# Altium schematic sheet in_out_ports.SchDoc
size A; SheetNumber: 2; SheetTotal: 4
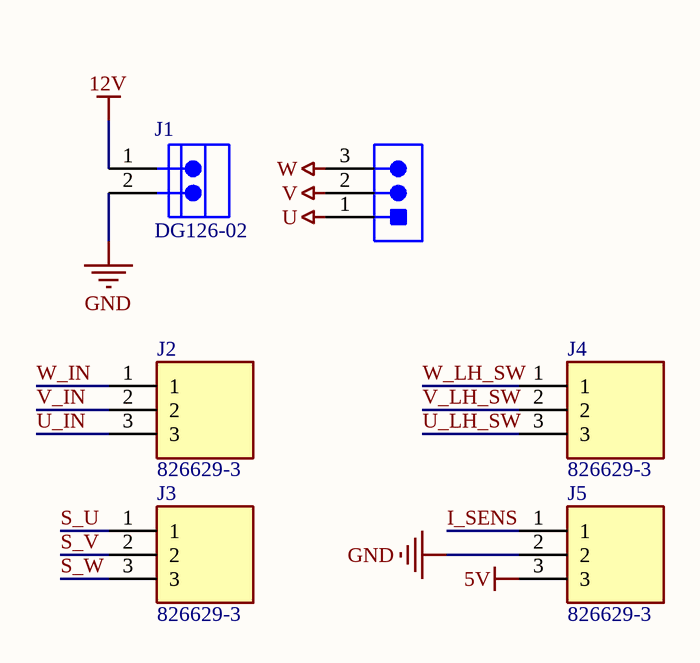
[diagram p0: in_out_ports.SchDoc]

## Parts
J1  DG126-02  [CXKF-KF129C-2_V]
J2  826629-3  [HDRV3W63P0X254_1X3_762X250X950P]
J3  826629-3  [HDRV3W63P0X254_1X3_762X250X950P]
J4  826629-3  [HDRV3W63P0X254_1X3_762X250X950P]
J5  826629-3  [HDRV3W63P0X254_1X3_762X250X950P]
MOTOR  SCREW-5.0/5.08 3WAYS  [SCREW-5.0-3WAYS_V]  (value not drawn)

## Nets
5V: J5.3
12V: J1.1
GND: J1.2 J5.2
U: MOTOR.1
V: MOTOR.2
W: MOTOR.3
I_SENS: J5.1
S_U: J3.1
S_V: J3.2
S_W: J3.3
U_IN: J2.3
U_LH_SW: J4.3
V_IN: J2.2
V_LH_SW: J4.2
W_IN: J2.1
W_LH_SW: J4.1

## Library data of the parts
J1 = CMP-0813-00004-1: Euro Terminal Block, 20 A, 300 V, -40 to 105 degC, Pitch 5 mm, 1 x 2 Position, Height 19.2 mm, Tail Length 3.5 mm; PartNumber: KF129C-02P-14; Manufacturer: Cixi KaiFeng; Insulation Resistance: 5000 MOhm / 1000 V; Pitch: Single Pitch; No. of Pole: 2; Rated Voltage: 300 V; Contact: Brass; Rated Current: 20 A; Contact Resistance: 20 mOhm; Withstanding Voltage: AC 1500 V / 1 Min; ComponentLink2Description: Datasheet; PackageReference: KF129C-2; ComponentLink1URL: http://www.nb-kaifeng.com/; ComponentLink2URL: http://www.nb-kaifeng.com/upload/editor/ext_pdf/201208170644598657.pdf; Color: Green; PackageDescription: Terminal Block, Pitch 5 mm, 1 x 2 Position, Height 19.2 mm, Tail Length 3.5 mm; Temp. Range: -40 to 105 degC; Mounting Technology: Through Hole; ComponentLink1Description: Manufacturer URL
J2-J5 = 826629-3: Connector; Manufacturer_Name: TE Connectivity; Datasheet Link: http://www.te.com/commerce/DocumentDelivery/DDEController?Action=showdoc&DocId=Customer+Drawing%7F826629%7FAA%7Fpdf%7FEnglish%7FENG_CD_826629_AA_baseFilename.pdf%7F826629-3.pdf; Height: 9.5mm; Manufacturer_Part_Number: 826629-3; Mouser Part Number: 571-826629-3; Mouser Price/Stock: https://www.mouser.co.uk/ProductDetail/TE-Connectivity/826629-3?qs=AplfTeSvkkA3hKOe%252BWTzDA%3D%3D; Arrow Part Number: 826629-3; Arrow Price/Stock: https://www.arrow.com/en/products/826629-3/te-connectivity?region=europe
MOTOR = CMP-0617-00010-1: Socket, Screw Terminal Block, 3 Way, 5.0 mm Pitch, 90 Degree Angle, Through-Hole; Manufacturer: No Vendor; Insulation Resistance: 5000 MOhm / 1000 V; Rated Voltage: 300 V; Poles: 3; Contact Resistance: 20 mOhm; Rated Current: 25 A; PartNumber: SCREW-5.0/5.08 3WAYS; PackageDescription: Socket, Screw Terminal Block, 3 Way, Pitch 5 mm, 90 Degree Angle, Through-Hole; Temperature Range: -40 to 105 degC; ComponentLink1Description: Datasheet; ComponentLink1URL: 5mm screw terminal in SVN; Mounting Technology: Through Hole